# Altium schematic sheet IGBT.SchDoc
size A; SheetNumber: 3; SheetTotal: 6
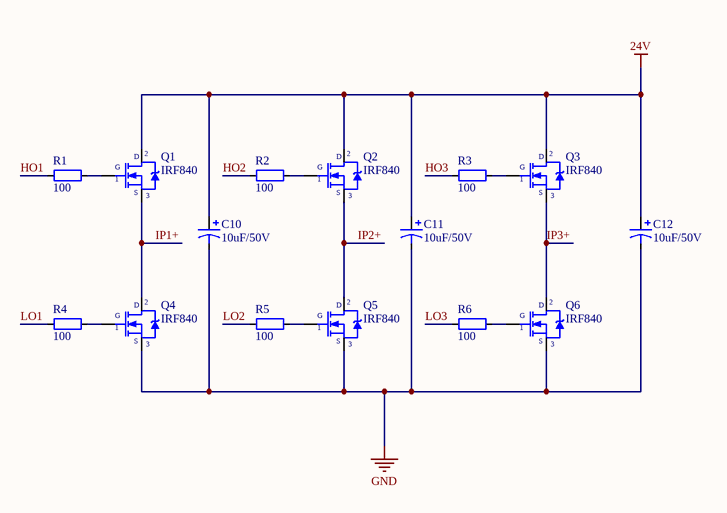
[diagram p0: IGBT.SchDoc]

## Parts
C10  10uF/50V  [C3MM]
C11  10uF/50V  [C3MM]
C12  10uF/50V  [C3MM]
Q1  IRF840  [QTO-220]
Q2  IRF840  [QTO-220]
Q3  IRF840  [QTO-220]
Q4  IRF840  [QTO-220]
Q5  IRF840  [QTO-220]
Q6  IRF840  [QTO-220]
R1  100  [RES-SMD-0101]
R2  100  [RES-SMD-0101]
R3  100  [RES-SMD-0101]
R4  100  [RES-SMD-0101]
R5  100  [RES-SMD-0101]
R6  100  [RES-SMD-0101]

## Nets
24V: C10.1 C11.1 C12.1 Q1.2(D) Q2.2(D) Q3.2(D)
GND: C10.2 C11.2 C12.2 Q4.3(S) Q5.3(S) Q6.3(S)
HO1: R1.1
HO2: R2.1
HO3: R3.1
IP1+: Q1.3(S) Q4.2(D)
IP2+: Q2.3(S) Q5.2(D)
IP3+: Q3.3(S) Q6.2(D)
LO1: R4.1
LO2: R5.1
LO3: R6.1
NetQ1_1: Q1.1(G) R1.2
NetQ2_1: Q2.1(G) R2.2
NetQ3_1: Q3.1(G) R3.2
NetQ4_1: Q4.1(G) R4.2
NetQ5_1: Q5.1(G) R5.2
NetQ6_1: Q6.1(G) R6.2

## Library data of the parts
C10-C12 = Cap Pol: Polarized Capacitor (Axial); Published: 8-Jun-2000; LatestRevisionDate: 17-Jul-2002; LatestRevisionNote: Re-released for DXP Platform.; PackageReference: POLAR0.8; Publisher: Altium Limited
Q1-Q6 = IRF840: MOSFET N - CHANNEL 500V - 0.75 - 8A - TO-220; Value: IRF840
R1-R6 = Resistor - SMD: Resistor; Manufacturer: Generic Components; Class: Passive; Published: 08/06/2000; Publisher: Altium Hobart Technology Centre